# Altium schematic sheet Touch XPT2046.SchDoc
size A; SheetNumber: 12; SheetTotal: 13
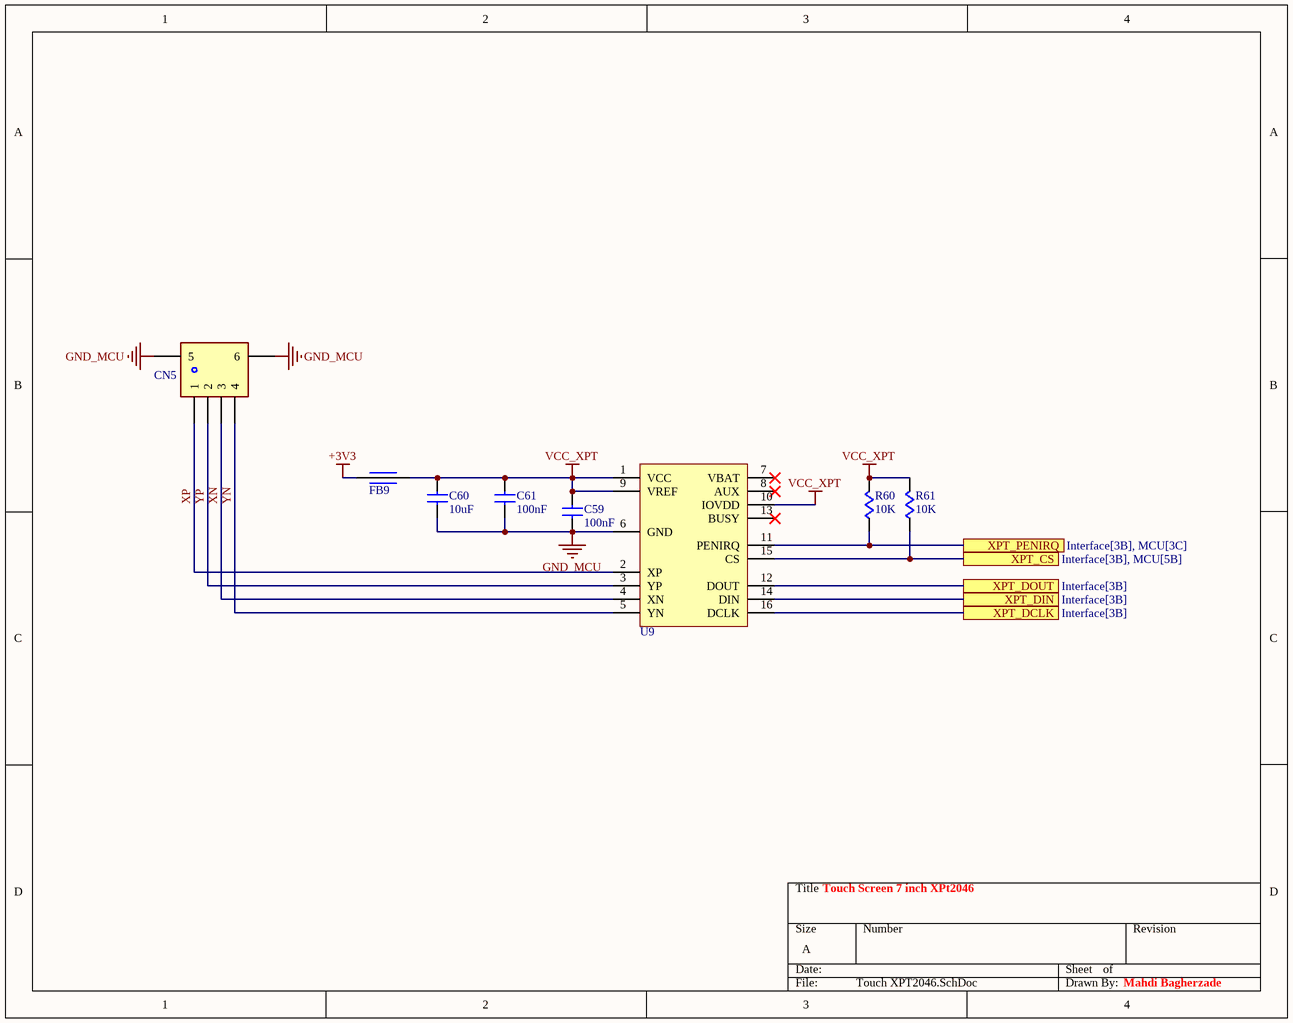
[diagram p0: Touch XPT2046.SchDoc]

## Parts
C59  value 100nF  [C-0805]  (hidden comment: CAP Cer 100nF-50V-X7R-SMD)
C60  value 10uF  [C-0805]  (hidden comment: CAP Cer 10uF-50V-X7R-SMD)
C61  value 100nF  [C-0805]  (hidden comment: CAP Cer 100nF-50V-X7R-SMD)
CN5  Connector FPC Right-1mm-4 Pin  [CN-FPC-4-1mm-hor]  (value not drawn)
FB9  Ferrite Bead SMD  [FB-0805]  (value not drawn)
R60  value 10K  [R-0805]  (hidden comment: RES 10K-5%-1/8W-SMD)
R61  value 10K  [R-0805]  (hidden comment: RES 10K-5%-1/8W-SMD)
U9  IC XPT2046-SMD  [TSSOP-16]  (value not drawn)

## Ports
XPT_CS (see Interface[3B], MCU[5B]), XPT_DCLK (see Interface[3B]), XPT_DIN (see Interface[3B]), XPT_DOUT (see Interface[3B]), XPT_PENIRQ (see Interface[3B], MCU[3C])

## Nets
+3V3: FB9.1
GND_MCU: C59.2 C60.2 C61.2 CN5.5 CN5.6 U9.6(GND)
VCC_XPT: C59.1 C60.1 C61.1 FB9.2 R60.2 R61.2 U9.1(VCC) U9.9(VREF) U9.10(IOVDD)
XN: CN5.3 U9.4(XN)
XP: CN5.1 U9.2(XP)
XPT_CS: R61.1 U9.15(CS) ; port XPT_CS
XPT_DCLK: U9.16(DCLK) ; port XPT_DCLK
XPT_DIN: U9.14(DIN) ; port XPT_DIN
XPT_DOUT: U9.12(DOUT) ; port XPT_DOUT
XPT_PENIRQ: R60.1 U9.11(PENIRQ) ; port XPT_PENIRQ
YN: CN5.4 U9.5(YN)
YP: CN5.2 U9.3(YP)

Not connected (* = marked no-connect by the designer): U9 7(VBAT)* 8(AUX)* 13(BUSY)*

## Notes on the sheet
- Touch Screen 7 inch XPt2046
- Mahdi Bagherzade

## Library data of the parts
C59-C61 = CAP-CER: CAPACITOR; Phone Number: 0915 8700 314; Voltage: 50V; Tolerance: X7R; Type: SMD; Publisher: Mahdi Bagherzadeh; ComponentLink1Description: Linkedin; ComponentLink1URL: https://ir.linkedin.com/in/mahdi-bagherzade; Published Date: 9-15-2024
CN5 = CN-FPC-4pin: CONNECTOR; Phone Number: 0915 8700 314; Publisher: Mahdi Bagherzadeh; ComponentLink1Description: Linkedin; ComponentLink1URL: https://ir.linkedin.com/in/mahdi-bagherzade; Published Date: 9-15-2024; Size: 1mm-4 Pin; Type: Right
FB9 = FERRITE BEAD: INDUCATOR; Phone Number: 0915 8700 314; Publisher: Mahdi Bagherzadeh; ComponentLink1Description: Linkedin; ComponentLink1URL: https://ir.linkedin.com/in/mahdi-bagherzade; Published Date: 9-15-2024; Type: SMD
R60 R61 = RES: RESISTOR; Phone Number: 0915 8700 314; Power: 1/8W; Tolerance: 5%; Publisher: Mahdi Bagherzadeh; ComponentLink1Description: Linkedin; ComponentLink1URL: https://ir.linkedin.com/in/mahdi-bagherzade; Published Date: 9-15-2024; Type: SMD
U9 = XPT2046: IC; Phone Number: 0915 8700 314; Publisher: Mahdi Bagherzadeh; ComponentLink1Description: Linkedin; ComponentLink1URL: https://ir.linkedin.com/in/mahdi-bagherzade; Published Date: 9-15-2024; Code: XPT2046; Type: SMD